# Altium schematic sheet dmpro16-pcb-v1-DisplayBoard.SchDoc
size A4; DocumentNumber: 3; SheetNumber: 3; SheetTotal: 17; SheetName: DisplayBoard
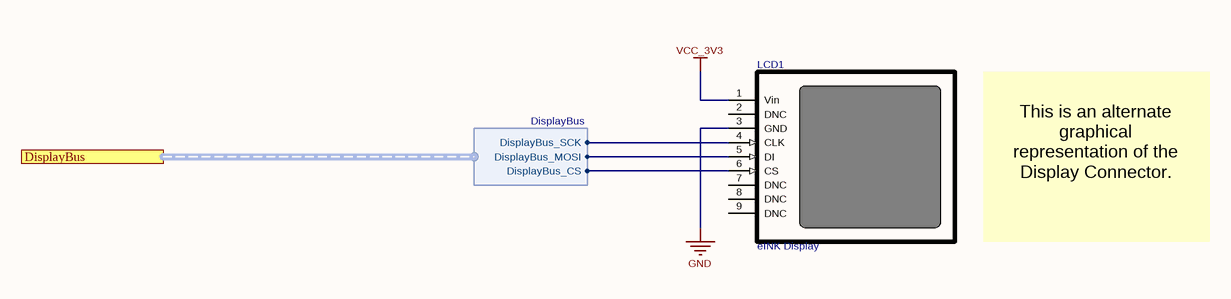
[diagram p0: dmpro16-pcb-v1-DisplayBoard.SchDoc]

## Parts
LCD1  eINK Display  [HEADER_1X9]

## Ports
DisplayBus (harness DisplayBus)

## Harnesses
DisplayBus: DisplayBus_MOSI, DisplayBus_SCK, DisplayBus_CS

## Nets
GND: LCD1.3(GND)
VCC_3V3: LCD1.1(Vin)
NetLCD1_4: LCD1.4(CLK) ; port DisplayBus.DisplayBus_SCK
NetLCD1_5: LCD1.5(DI) ; port DisplayBus.DisplayBus_MOSI
NetLCD1_6: LCD1.6(CS) ; port DisplayBus.DisplayBus_CS

Not connected (* = marked no-connect by the designer): LCD1 2(DNC) 7(DNC) 8(DNC) 9(DNC)

## Notes on the sheet
- This is an alternate graphical representation of the Display Connector.
- Board:
- Version:
- Sheetname:
- Subject:
- Group:
- Sheet
- of
- Shematic file:

## Library data of the parts
LCD1 = disp_eink